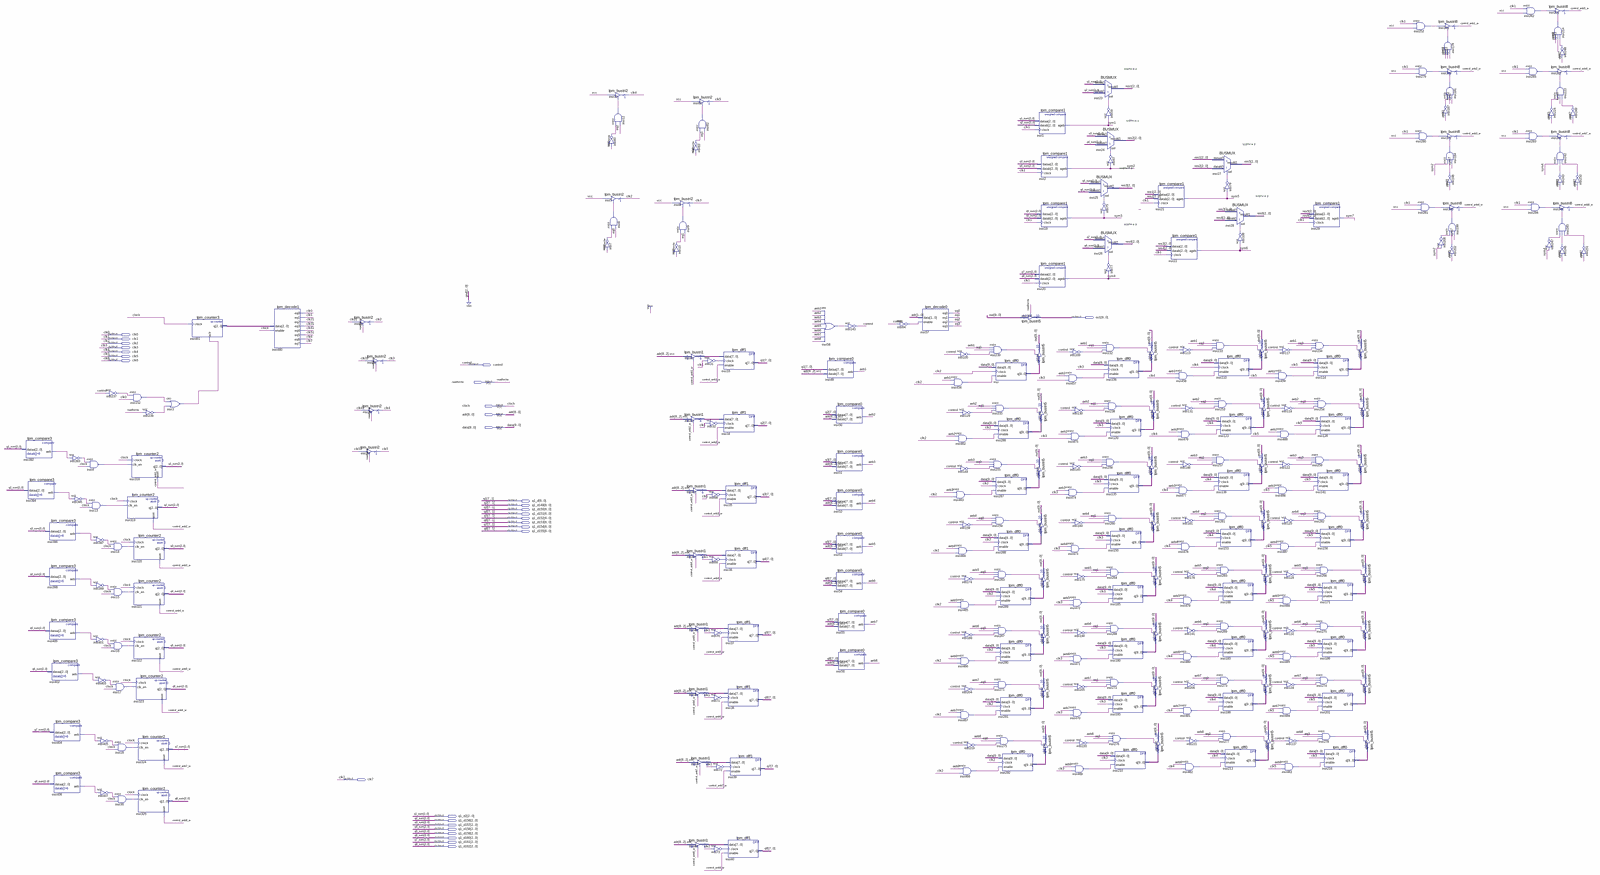
[diagram p0: schematic sheet, whole]
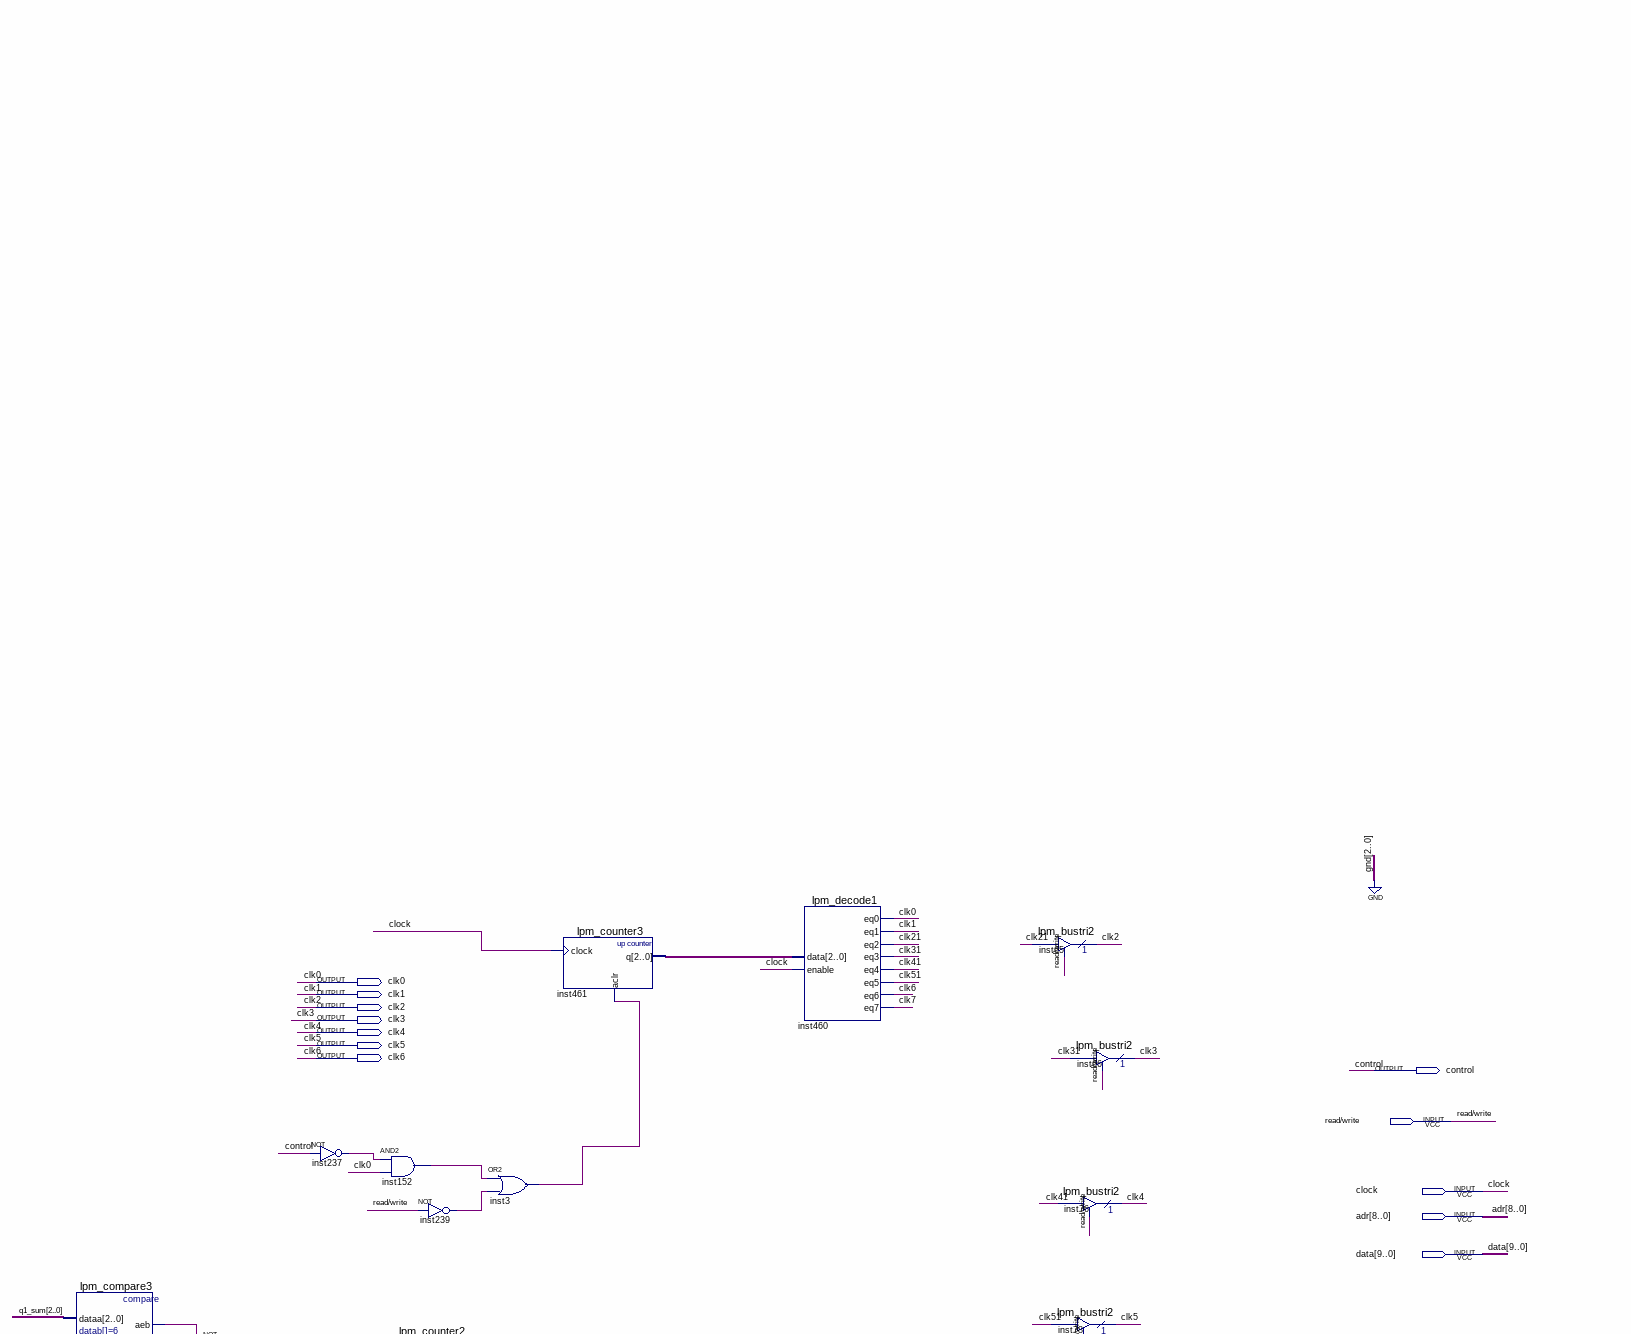
[diagram p1: schematic sheet, upper left part]
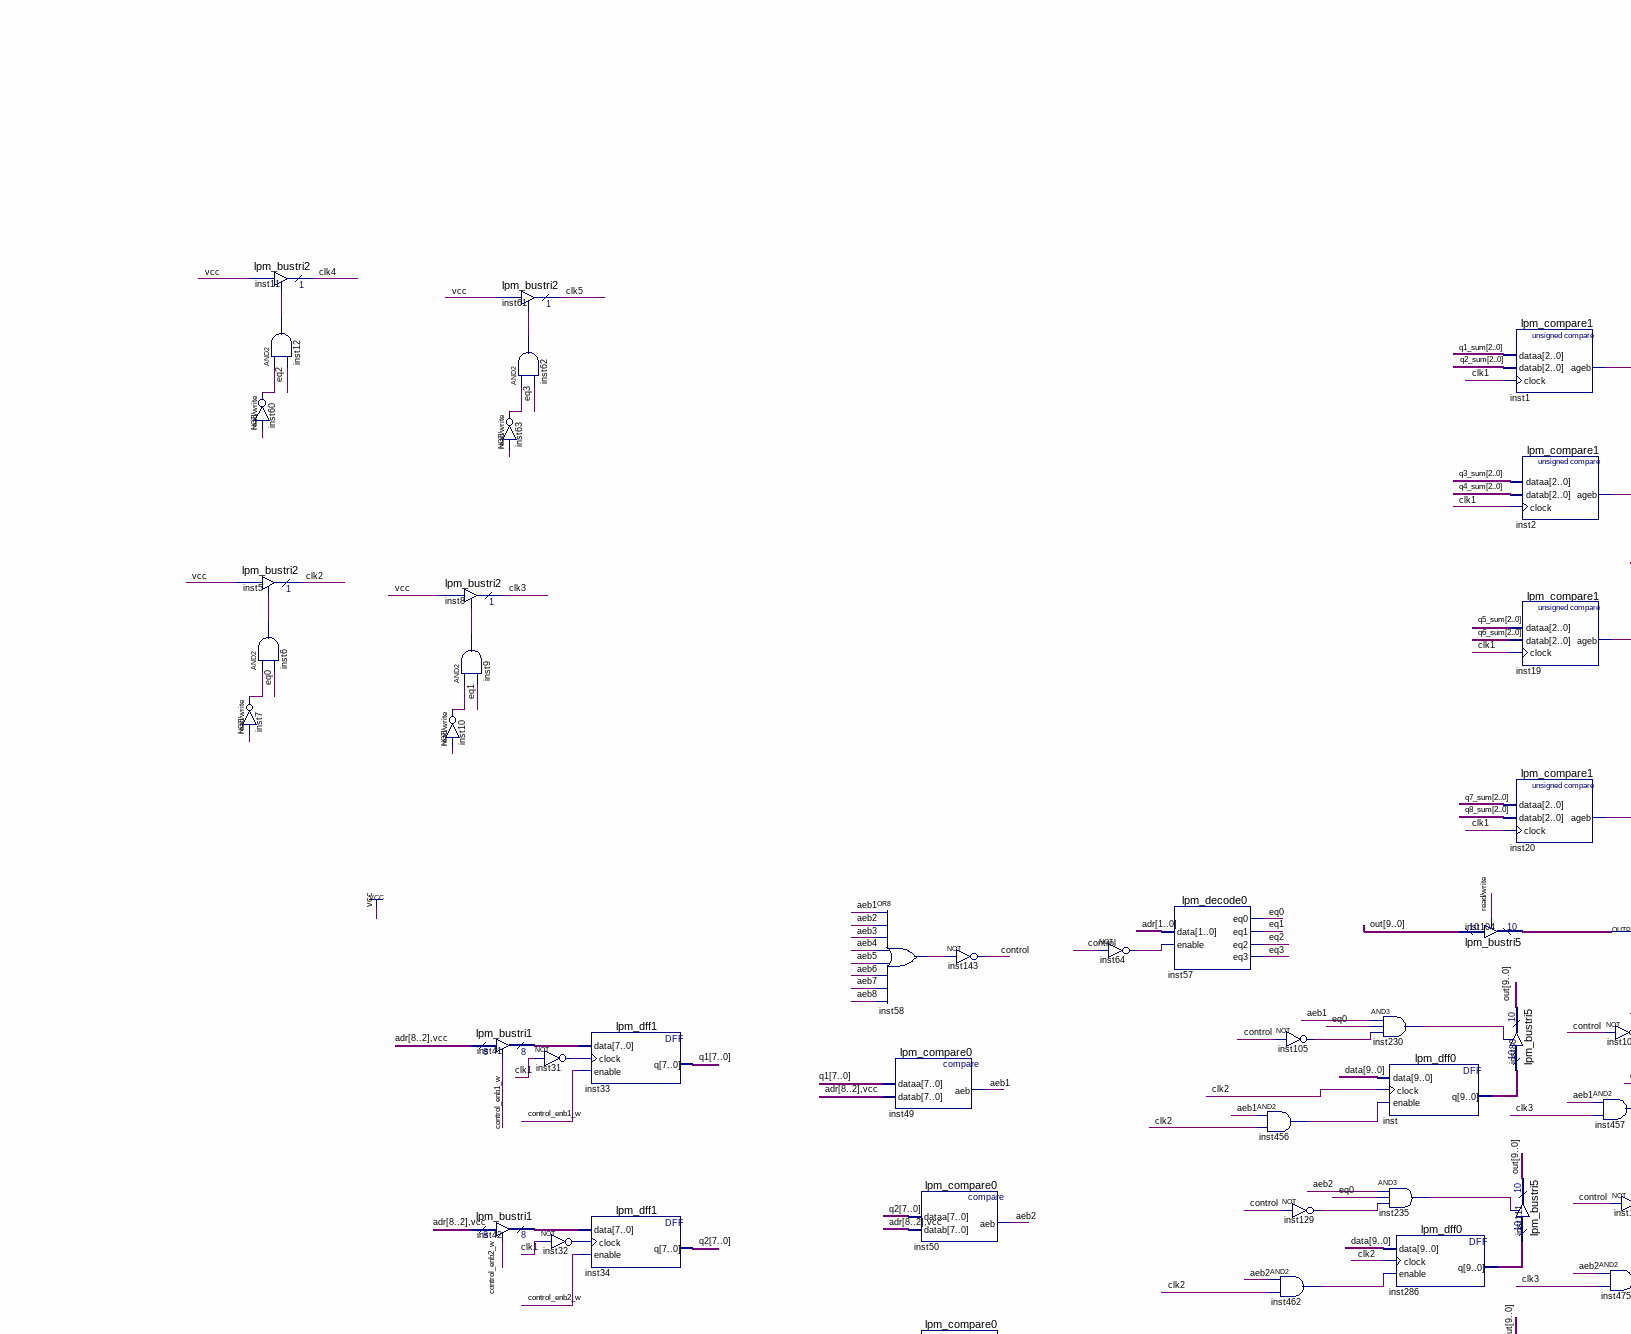
[diagram p2: schematic sheet, upper centre part]
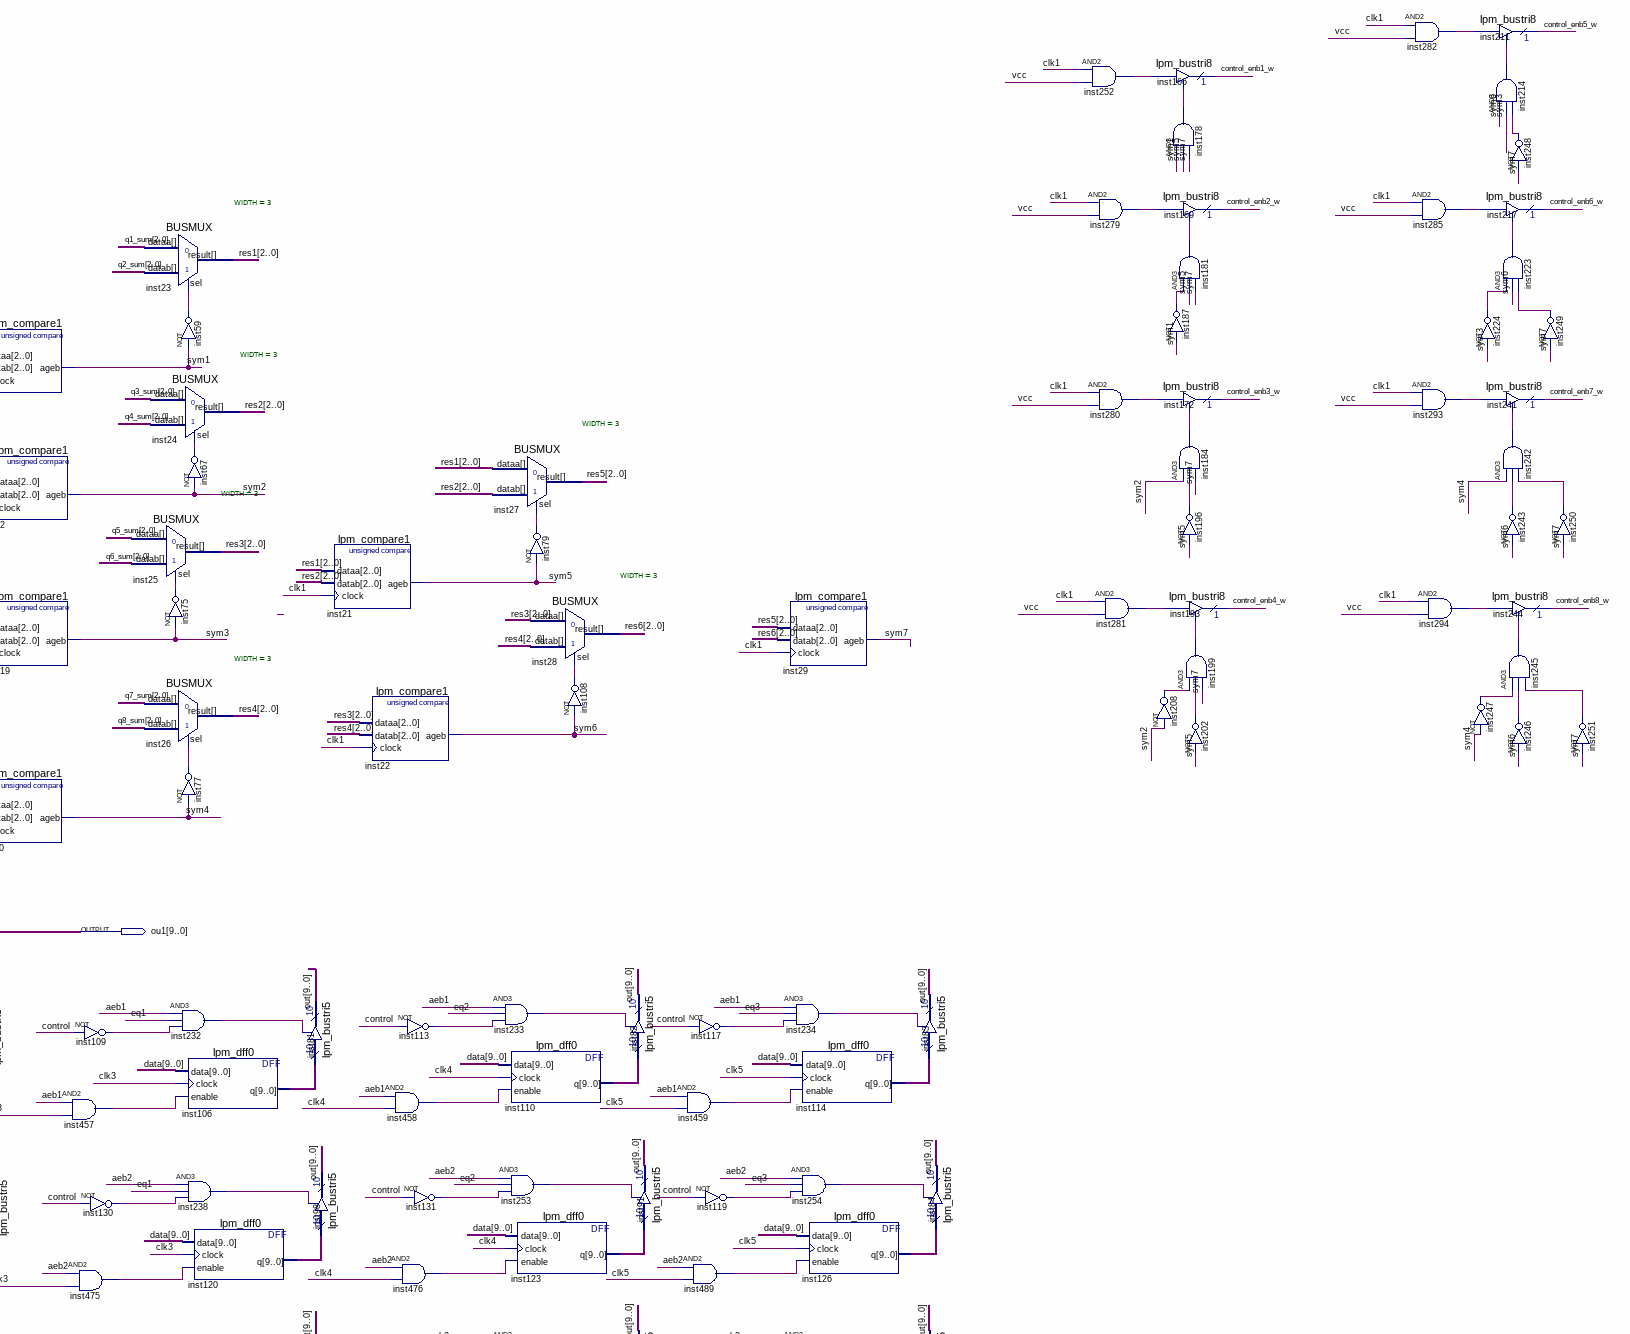
[diagram p3: schematic sheet, upper right part]
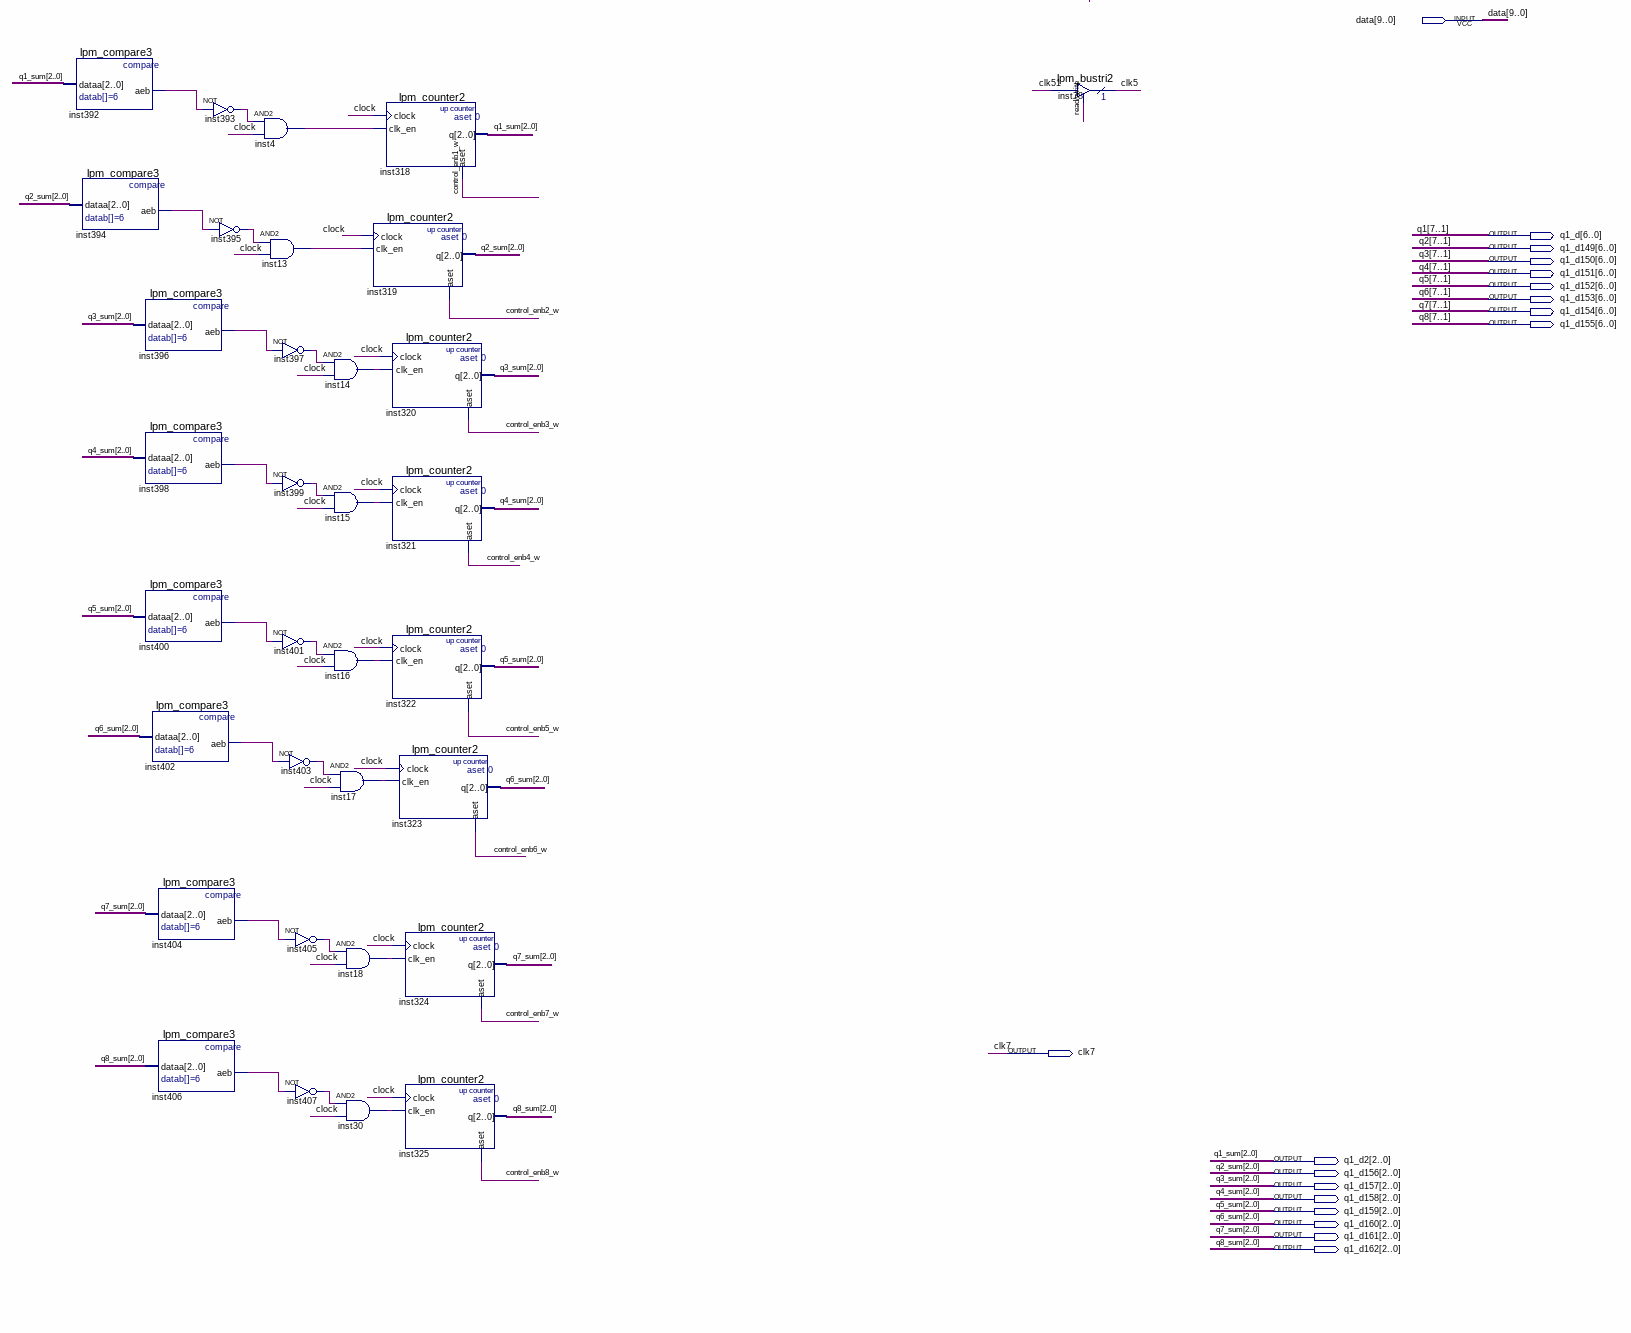
[diagram p4: schematic sheet, lower left part]
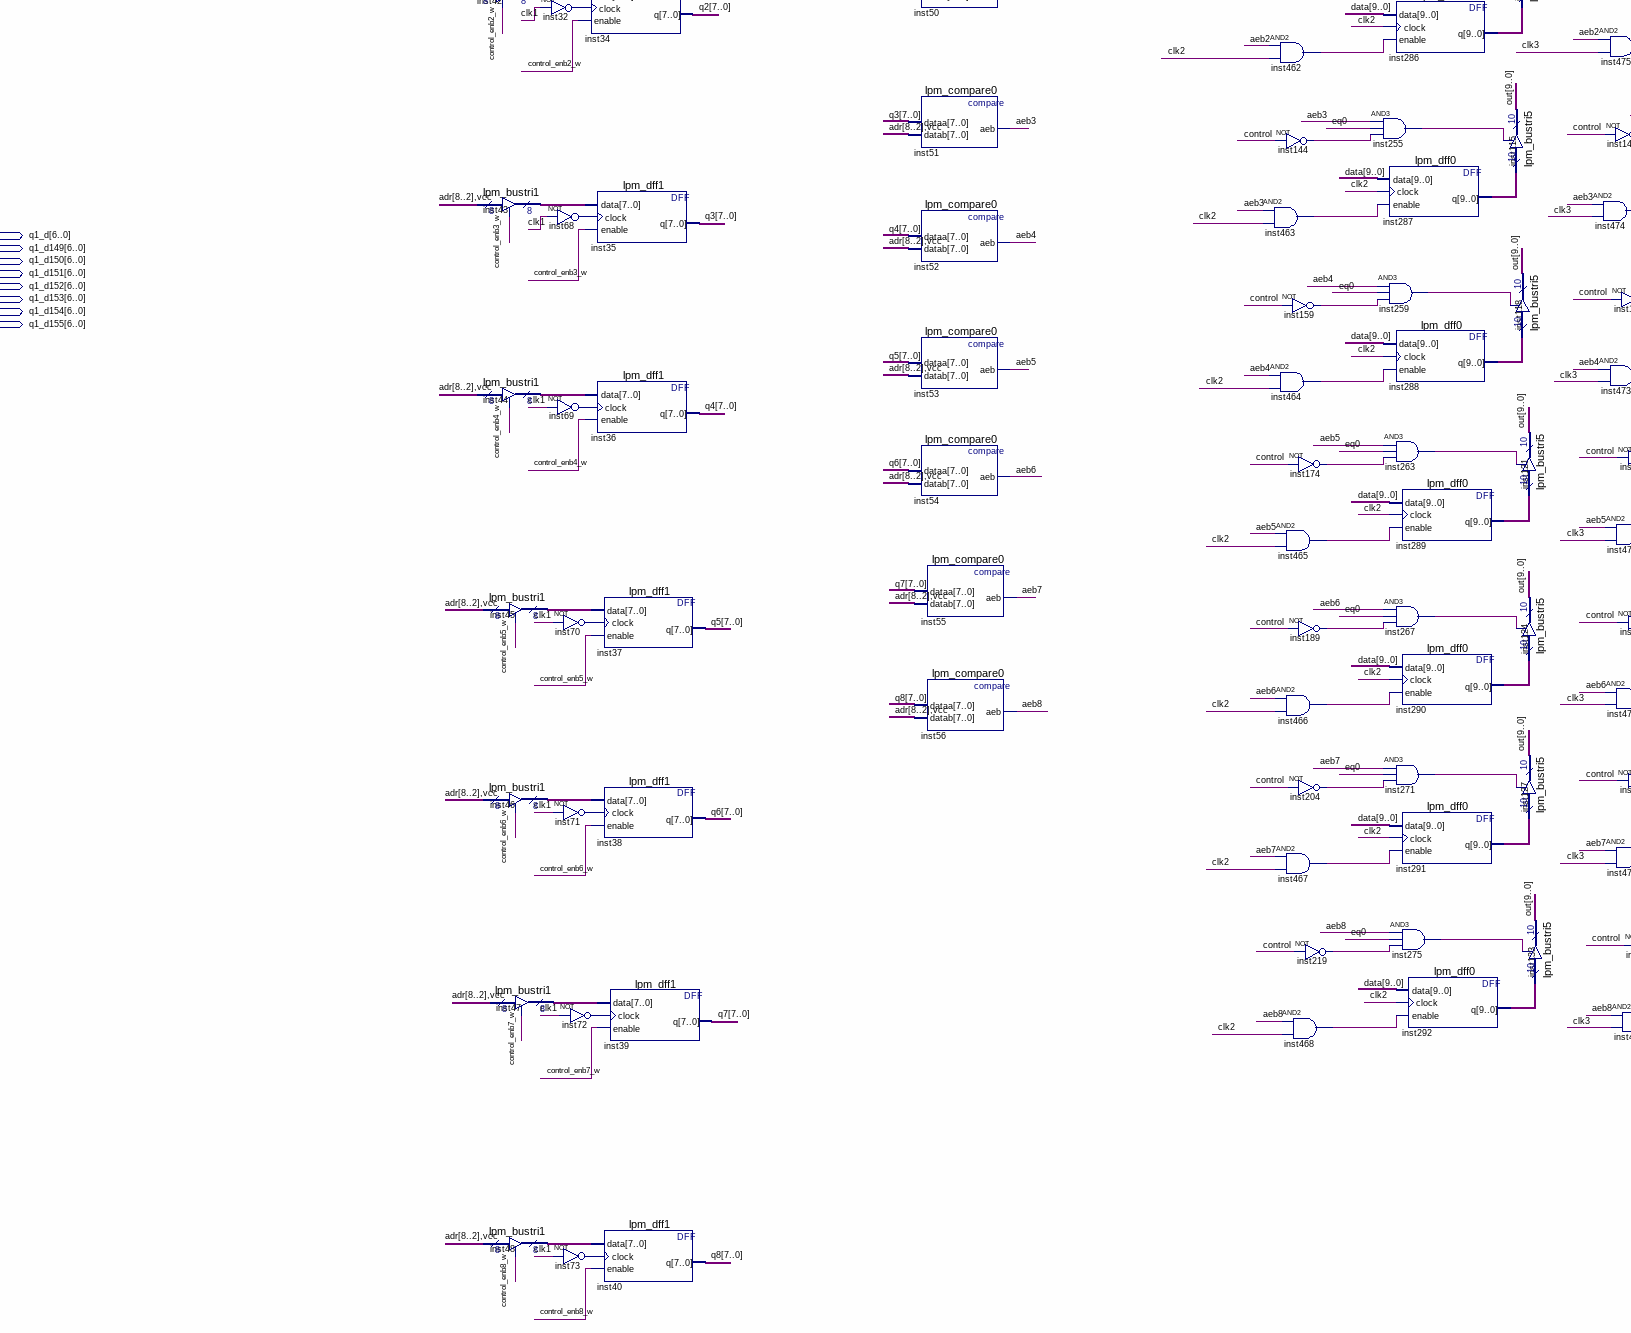
[diagram p5: schematic sheet, lower centre part]
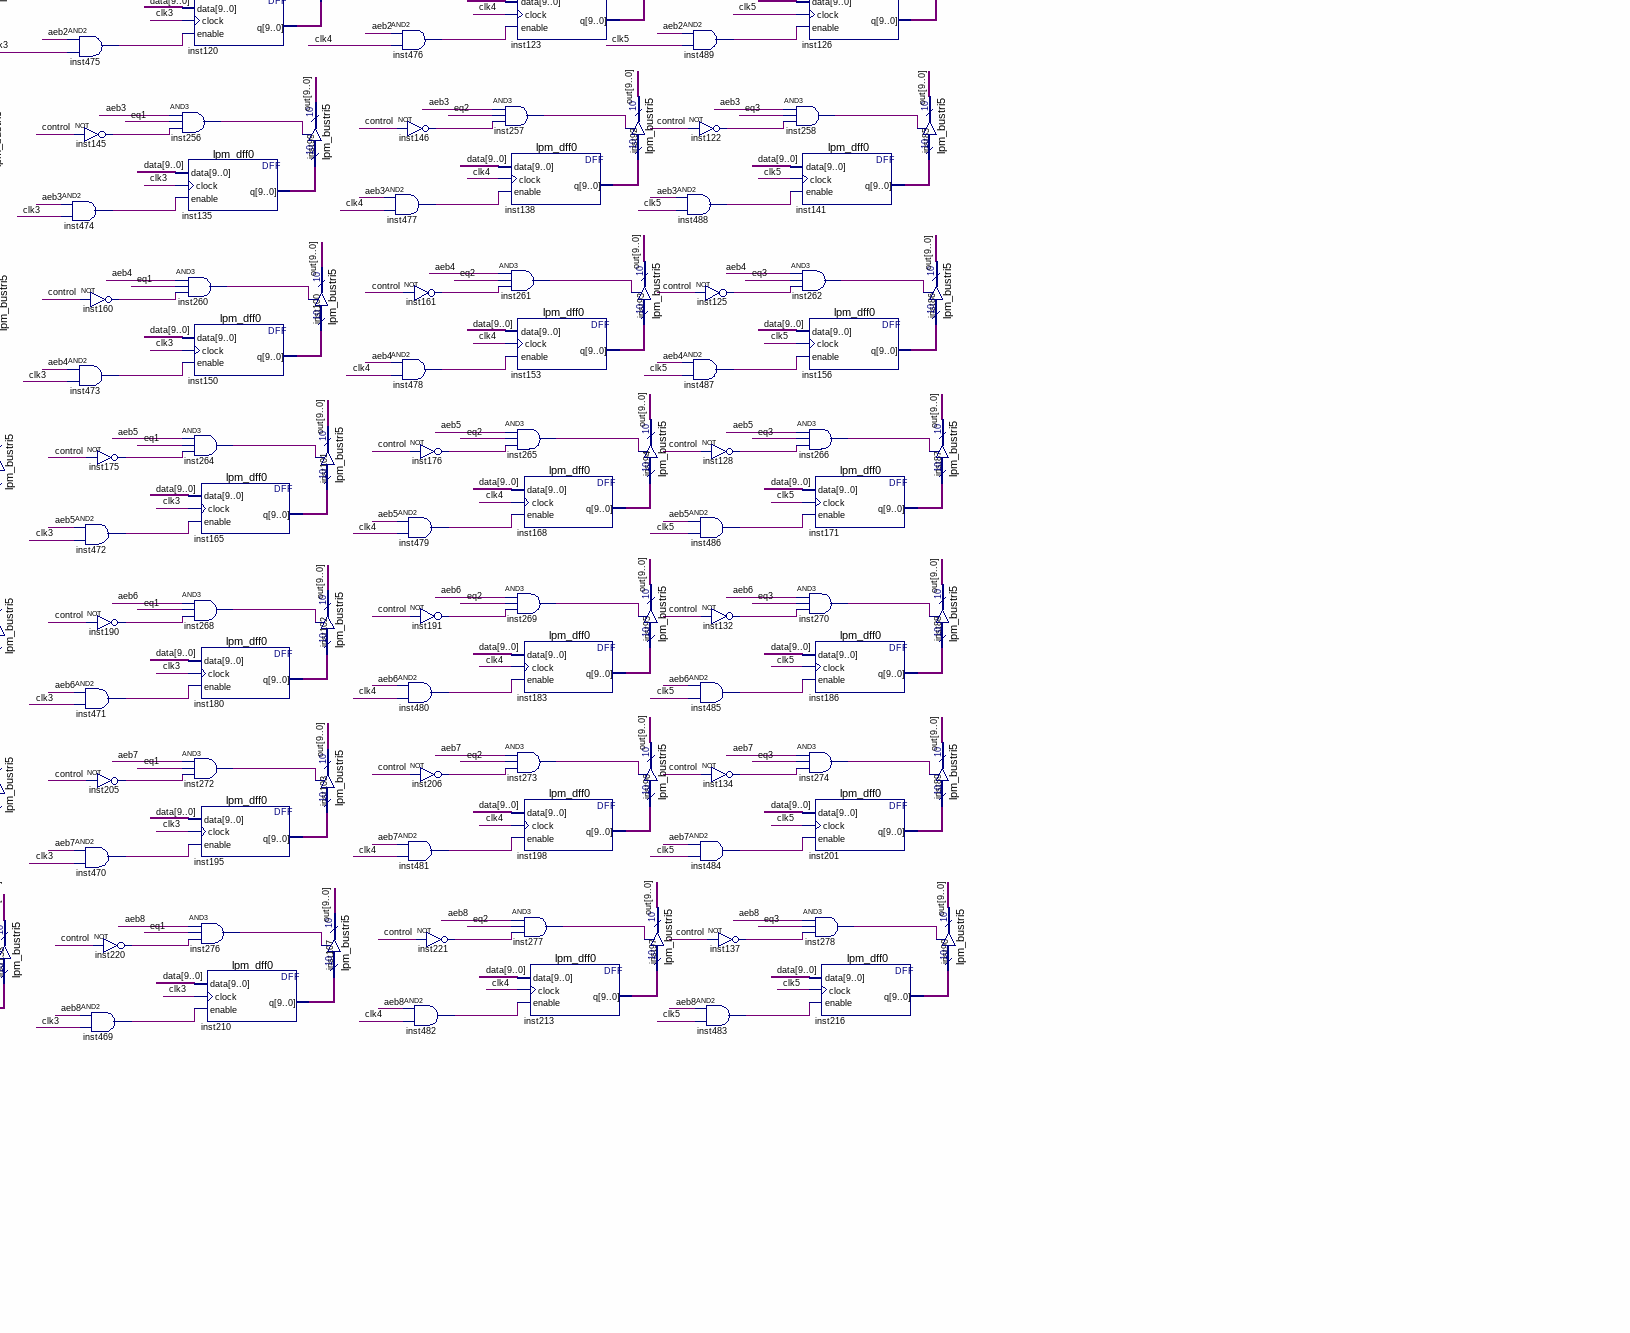
[diagram p6: schematic sheet, lower right part]
// Quartus schematic cache.bdf as structural Verilog: 306 symbols, 30 pins
module cache (
  input  \read/write ,
  input  clock,
  input  [8:0] adr,
  input  [9:0] data,
  output [9:0] ou1,
  output clk0,
  output clk1,
  output clk2,
  output clk3,
  output clk4,
  output clk5,
  output clk6,
  output control,
  output [6:0] q1_d,
  output [6:0] q1_d149,
  output [6:0] q1_d150,
  output [6:0] q1_d151,
  output [6:0] q1_d152,
  output [6:0] q1_d153,
  output [6:0] q1_d154,
  output [6:0] q1_d155,
  output clk7,
  output [2:0] q1_d2,
  output [2:0] q1_d156,
  output [2:0] q1_d157,
  output [2:0] q1_d158,
  output [2:0] q1_d159,
  output [2:0] q1_d160,
  output [2:0] q1_d161,
  output [2:0] q1_d162
);

  wire aeb1, aeb2, aeb3, aeb4, aeb5, aeb6, aeb7, aeb8, clk21, clk31, clk41, clk51, control_enb1_w,
       control_enb2_w, control_enb3_w, control_enb4_w, control_enb5_w, control_enb6_w, control_enb7_w,
       control_enb8_w, eq0, eq1, eq2, eq3, inst3_out, inst4_out, inst6_out, inst7_out, inst9_out, inst10_out,
       inst12_out, inst13_out, inst14_out, inst15_out, inst16_out, inst17_out, inst18_out, inst30_out,
       inst31_out, inst32_out, inst58_out, inst59_out, inst60_out, inst62_out, inst63_out, inst64_out,
       inst67_out, inst68_out, inst69_out, inst70_out, inst71_out, inst72_out, inst73_out, inst75_out,
       inst77_out, inst79_out, inst105_out, inst108_out, inst109_out, inst113_out, inst117_out, inst119_out,
       inst122_out, inst125_out, inst128_out, inst129_out, inst130_out, inst131_out, inst132_out,
       inst134_out, inst137_out, inst144_out, inst145_out, inst146_out, inst152_out, inst159_out,
       inst160_out, inst161_out, inst174_out, inst175_out, inst176_out, inst178_out, inst181_out,
       inst184_out, inst187_out, inst189_out, inst190_out, inst191_out, inst196_out, inst199_out,
       inst202_out, inst204_out, inst205_out, inst206_out, inst208_out, inst214_out, inst219_out,
       inst220_out, inst221_out, inst223_out, inst224_out, inst230_out, inst232_out, inst233_out,
       inst234_out, inst235_out, inst237_out, inst238_out, inst239_out, inst242_out, inst243_out,
       inst245_out, inst246_out, inst247_out, inst248_out, inst249_out, inst250_out, inst251_out,
       inst252_out, inst253_out, inst254_out, inst255_out, inst256_out, inst257_out, inst258_out,
       inst259_out, inst260_out, inst261_out, inst262_out, inst263_out, inst264_out, inst265_out,
       inst266_out, inst267_out, inst268_out, inst269_out, inst270_out, inst271_out, inst272_out,
       inst273_out, inst274_out, inst275_out, inst276_out, inst277_out, inst278_out, inst279_out,
       inst280_out, inst281_out, inst282_out, inst285_out, inst293_out, inst294_out, inst392_aeb,
       inst393_out, inst394_aeb, inst395_out, inst396_aeb, inst397_out, inst398_aeb, inst399_out,
       inst400_aeb, inst401_out, inst402_aeb, inst403_out, inst404_aeb, inst405_out, inst406_aeb,
       inst407_out, inst456_out, inst457_out, inst458_out, inst459_out, inst462_out, inst463_out,
       inst464_out, inst465_out, inst466_out, inst467_out, inst468_out, inst469_out, inst470_out,
       inst471_out, inst472_out, inst473_out, inst474_out, inst475_out, inst476_out, inst477_out,
       inst478_out, inst479_out, inst480_out, inst481_out, inst482_out, inst483_out, inst484_out,
       inst485_out, inst486_out, inst487_out, inst488_out, inst489_out, sym1, sym2, sym3, sym4, sym5, sym6,
       sym7;
  wire [0:0] q1, q2, q3, q4, q5, q6, q7, q8;
  wire [2:0] inst461_q, res1, res2, res3, res4, res5, res6;
  wire [7:0] inst41_tridata, inst42_tridata, inst43_tridata, inst44_tridata, inst45_tridata, inst46_tridata,
       inst47_tridata, inst48_tridata;
  wire [9:0] inst106_q, inst110_q, inst114_q, inst120_q, inst123_q, inst126_q, inst135_q, inst138_q,
       inst141_q, inst150_q, inst153_q, inst156_q, inst165_q, inst168_q, inst171_q, inst180_q, inst183_q,
       inst186_q, inst195_q, inst198_q, inst201_q, inst210_q, inst213_q, inst216_q, inst286_q, inst287_q,
       inst288_q, inst289_q, inst290_q, inst291_q, inst292_q, inst_q, out;

  lpm_compare3 inst392 (.dataa(q1_d2), .aeb(inst392_aeb));
  lpm_compare3 inst394 (.dataa(q1_d156), .aeb(inst394_aeb));
  lpm_compare3 inst396 (.dataa(q1_d157), .aeb(inst396_aeb));
  lpm_compare3 inst398 (.dataa(q1_d158), .aeb(inst398_aeb));
  lpm_compare3 inst400 (.dataa(q1_d159), .aeb(inst400_aeb));
  lpm_compare3 inst402 (.dataa(q1_d160), .aeb(inst402_aeb));
  lpm_compare3 inst404 (.dataa(q1_d161), .aeb(inst404_aeb));
  lpm_compare3 inst406 (.dataa(q1_d162), .aeb(inst406_aeb));
  not inst393 (inst393_out, inst392_aeb);
  not inst395 (inst395_out, inst394_aeb);
  and inst4 (inst4_out, inst393_out, clock);
  and inst13 (inst13_out, inst395_out, clock);
  not inst397 (inst397_out, inst396_aeb);
  not inst399 (inst399_out, inst398_aeb);
  not inst401 (inst401_out, inst400_aeb);
  not inst403 (inst403_out, inst402_aeb);
  not inst405 (inst405_out, inst404_aeb);
  not inst407 (inst407_out, inst406_aeb);
  not inst237 (inst237_out, control);
  and inst14 (inst14_out, inst397_out, clock);
  and inst15 (inst15_out, inst399_out, clock);
  and inst16 (inst16_out, inst401_out, clock);
  and inst17 (inst17_out, inst403_out, clock);
  and inst18 (inst18_out, inst405_out, clock);
  and inst30 (inst30_out, inst407_out, clock);
  and inst152 (inst152_out, inst237_out, clk0);
  lpm_counter2 inst318 (.clock(clock), .clk_en(inst4_out), .aset(control_enb1_w), .q(q1_d2));
  lpm_counter2 inst319 (.clock(clock), .clk_en(inst13_out), .aset(control_enb2_w), .q(q1_d156));
  lpm_counter2 inst320 (.clock(clock), .clk_en(inst14_out), .aset(control_enb3_w), .q(q1_d157));
  lpm_counter2 inst321 (.clock(clock), .clk_en(inst15_out), .aset(control_enb4_w), .q(q1_d158));
  lpm_counter2 inst322 (.clock(clock), .clk_en(inst16_out), .aset(control_enb5_w), .q(q1_d159));
  lpm_counter2 inst323 (.clock(clock), .clk_en(inst17_out), .aset(control_enb6_w), .q(q1_d160));
  lpm_counter2 inst324 (.clock(clock), .clk_en(inst18_out), .aset(control_enb7_w), .q(q1_d161));
  lpm_counter2 inst325 (.clock(clock), .clk_en(inst30_out), .aset(control_enb8_w), .q(q1_d162));
  not inst239 (inst239_out, \read/write );
  or inst3 (inst3_out, inst152_out, inst239_out);
  lpm_counter3 inst461 (.clock(clock), .aclr(inst3_out), .q(inst461_q));
  lpm_decode1 inst460 (
    .data(inst461_q), .enable(clock), .eq0(clk0), .eq1(clk1), .eq2(clk21), .eq3(clk31), .eq4(clk41),
    .eq5(clk51), .eq6(clk6), .eq7(clk7));
  lpm_bustri2 inst65 (.enabledt(\read/write ), .data(clk21), .tridata(clk2));
  lpm_bustri2 inst78 (.enabledt(\read/write ), .data(clk51), .tridata(clk5));
  lpm_bustri2 inst66 (.enabledt(\read/write ), .data(clk31), .tridata(clk3));
  lpm_bustri2 inst76 (.enabledt(\read/write ), .data(clk41), .tridata(clk4));
  lpm_bustri2 inst11 (.enabledt(inst12_out), .data(1'b1), .tridata(clk4));
  and inst12 (inst12_out, inst60_out, eq2);
  not inst60 (inst60_out, \read/write );
  lpm_bustri2 inst5 (.enabledt(inst6_out), .data(1'b1), .tridata(clk2));
  and inst6 (inst6_out, inst7_out, eq0);
  not inst7 (inst7_out, \read/write );
  lpm_bustri2 inst8 (.enabledt(inst9_out), .data(1'b1), .tridata(clk3));
  and inst9 (inst9_out, inst10_out, eq1);
  not inst10 (inst10_out, \read/write );
  lpm_bustri1 inst41 (.enabledt(control_enb1_w), .data({adr[8:2], 1'b1}), .tridata(inst41_tridata));
  lpm_bustri1 inst42 (.enabledt(control_enb2_w), .data({adr[8:2], 1'b1}), .tridata(inst42_tridata));
  lpm_bustri1 inst43 (.enabledt(control_enb3_w), .data({adr[8:2], 1'b1}), .tridata(inst43_tridata));
  lpm_bustri1 inst44 (.enabledt(control_enb4_w), .data({adr[8:2], 1'b1}), .tridata(inst44_tridata));
  lpm_bustri1 inst45 (.enabledt(control_enb5_w), .data({adr[8:2], 1'b1}), .tridata(inst45_tridata));
  lpm_bustri1 inst46 (.enabledt(control_enb6_w), .data({adr[8:2], 1'b1}), .tridata(inst46_tridata));
  lpm_bustri1 inst48 (.enabledt(control_enb8_w), .data({adr[8:2], 1'b1}), .tridata(inst48_tridata));
  lpm_bustri2 inst61 (.enabledt(inst62_out), .data(1'b1), .tridata(clk5));
  and inst62 (inst62_out, inst63_out, eq3);
  not inst63 (inst63_out, \read/write );
  not inst31 (inst31_out, clk1);
  lpm_bustri1 inst47 (.enabledt(control_enb7_w), .data({adr[8:2], 1'b1}), .tridata(inst47_tridata));
  lpm_dff1 inst33 (.data(inst41_tridata), .clock(inst31_out), .enable(control_enb1_w), .q({q1_d, q1[0]}));
  lpm_dff1 inst34 (.data(inst42_tridata), .clock(inst32_out), .enable(control_enb2_w), .q({q1_d149, q2[0]}));
  not inst32 (inst32_out, clk1);
  lpm_dff1 inst35 (.data(inst43_tridata), .clock(inst68_out), .enable(control_enb3_w), .q({q1_d150, q3[0]}));
  not inst68 (inst68_out, clk1);
  lpm_dff1 inst36 (.data(inst44_tridata), .clock(inst69_out), .enable(control_enb4_w), .q({q1_d151, q4[0]}));
  not inst69 (inst69_out, clk1);
  not inst70 (inst70_out, clk1);
  not inst71 (inst71_out, clk1);
  not inst72 (inst72_out, clk1);
  not inst73 (inst73_out, clk1);
  lpm_dff1 inst37 (.data(inst45_tridata), .clock(inst70_out), .enable(control_enb5_w), .q({q1_d152, q5[0]}));
  lpm_dff1 inst38 (.data(inst46_tridata), .clock(inst71_out), .enable(control_enb6_w), .q({q1_d153, q6[0]}));
  lpm_dff1 inst39 (.data(inst47_tridata), .clock(inst72_out), .enable(control_enb7_w), .q({q1_d154, q7[0]}));
  lpm_dff1 inst40 (.data(inst48_tridata), .clock(inst73_out), .enable(control_enb8_w), .q({q1_d155, q8[0]}));
  or inst58 (inst58_out, aeb1, aeb2, aeb3, aeb4, aeb5, aeb6, aeb7, aeb8);
  lpm_compare0 inst49 (.dataa({q1_d, q1[0]}), .datab({adr[8:2], 1'b1}), .aeb(aeb1));
  lpm_compare0 inst50 (.dataa({q1_d149, q2[0]}), .datab({adr[8:2], 1'b1}), .aeb(aeb2));
  lpm_compare0 inst51 (.dataa({q1_d150, q3[0]}), .datab({adr[8:2], 1'b1}), .aeb(aeb3));
  lpm_compare0 inst52 (.dataa({q1_d151, q4[0]}), .datab({adr[8:2], 1'b1}), .aeb(aeb4));
  lpm_compare0 inst53 (.dataa({q1_d152, q5[0]}), .datab({adr[8:2], 1'b1}), .aeb(aeb5));
  lpm_compare0 inst54 (.dataa({q1_d153, q6[0]}), .datab({adr[8:2], 1'b1}), .aeb(aeb6));
  lpm_compare0 inst55 (.dataa({q1_d154, q7[0]}), .datab({adr[8:2], 1'b1}), .aeb(aeb7));
  lpm_compare0 inst56 (.dataa({q1_d155, q8[0]}), .datab({adr[8:2], 1'b1}), .aeb(aeb8));
  not inst143 (control, inst58_out);
  not inst64 (inst64_out, control);
  lpm_decode0 inst57 (.data(adr[1:0]), .enable(inst64_out), .eq0(eq0), .eq1(eq1), .eq2(eq2), .eq3(eq3));
  not inst105 (inst105_out, control);
  and inst456 (inst456_out, aeb1, clk2);
  not inst129 (inst129_out, control);
  and inst462 (inst462_out, aeb2, clk2);
  not inst144 (inst144_out, control);
  and inst463 (inst463_out, aeb3, clk2);
  not inst159 (inst159_out, control);
  and inst464 (inst464_out, aeb4, clk2);
  not inst174 (inst174_out, control);
  and inst465 (inst465_out, aeb5, clk2);
  not inst189 (inst189_out, control);
  and inst466 (inst466_out, aeb6, clk2);
  not inst204 (inst204_out, control);
  and inst467 (inst467_out, aeb7, clk2);
  not inst219 (inst219_out, control);
  and inst468 (inst468_out, aeb8, clk2);
  and inst230 (inst230_out, aeb1, eq0, inst105_out);
  lpm_dff0 inst (.data(data), .clock(clk2), .enable(inst456_out), .q(inst_q));
  and inst235 (inst235_out, aeb2, eq0, inst129_out);
  lpm_dff0 inst286 (.data(data), .clock(clk2), .enable(inst462_out), .q(inst286_q));
  and inst255 (inst255_out, aeb3, eq0, inst144_out);
  lpm_dff0 inst287 (.data(data), .clock(clk2), .enable(inst463_out), .q(inst287_q));
  and inst259 (inst259_out, aeb4, eq0, inst159_out);
  lpm_dff0 inst288 (.data(data), .clock(clk2), .enable(inst464_out), .q(inst288_q));
  and inst263 (inst263_out, aeb5, eq0, inst174_out);
  lpm_dff0 inst289 (.data(data), .clock(clk2), .enable(inst465_out), .q(inst289_q));
  and inst267 (inst267_out, aeb6, eq0, inst189_out);
  lpm_dff0 inst290 (.data(data), .clock(clk2), .enable(inst466_out), .q(inst290_q));
  and inst271 (inst271_out, aeb7, eq0, inst204_out);
  lpm_dff0 inst291 (.data(data), .clock(clk2), .enable(inst467_out), .q(inst291_q));
  and inst275 (inst275_out, aeb8, eq0, inst219_out);
  lpm_dff0 inst292 (.data(data), .clock(clk2), .enable(inst468_out), .q(inst292_q));
  lpm_bustri5 inst104 (.enabledt(\read/write ), .data(out), .tridata(ou1));
  lpm_compare1 inst1 (.dataa(q1_d2), .datab(q1_d156), .clock(clk1), .ageb(sym1));
  lpm_compare1 inst2 (.dataa(q1_d157), .datab(q1_d158), .clock(clk1), .ageb(sym2));
  lpm_compare1 inst19 (.dataa(q1_d159), .datab(q1_d160), .clock(clk1), .ageb(sym3));
  lpm_compare1 inst20 (.dataa(q1_d161), .datab(q1_d162), .clock(clk1), .ageb(sym4));
  lpm_bustri5 inst80 (.enabledt(inst230_out), .data(inst_q), .tridata(out));
  lpm_bustri5 inst111 (.enabledt(inst235_out), .data(inst286_q), .tridata(out));
  lpm_bustri5 inst115 (.enabledt(inst255_out), .data(inst287_q), .tridata(out));
  lpm_bustri5 inst118 (.enabledt(inst259_out), .data(inst288_q), .tridata(out));
  lpm_bustri5 inst121 (.enabledt(inst263_out), .data(inst289_q), .tridata(out));
  lpm_bustri5 inst124 (.enabledt(inst267_out), .data(inst290_q), .tridata(out));
  lpm_bustri5 inst127 (.enabledt(inst271_out), .data(inst291_q), .tridata(out));
  lpm_bustri5 inst133 (.enabledt(inst275_out), .data(inst292_q), .tridata(out));
  and inst457 (inst457_out, aeb1, clk3);
  and inst475 (inst475_out, aeb2, clk3);
  and inst474 (inst474_out, aeb3, clk3);
  and inst473 (inst473_out, aeb4, clk3);
  not inst109 (inst109_out, control);
  not inst130 (inst130_out, control);
  not inst145 (inst145_out, control);
  not inst160 (inst160_out, control);
  not inst175 (inst175_out, control);
  and inst472 (inst472_out, aeb5, clk3);
  not inst190 (inst190_out, control);
  and inst471 (inst471_out, aeb6, clk3);
  not inst205 (inst205_out, control);
  and inst470 (inst470_out, aeb7, clk3);
  not inst220 (inst220_out, control);
  and inst469 (inst469_out, aeb8, clk3);
  BUSMUX #(.WIDTH(3)) inst23 (.datab(q1_d156), .sel(inst59_out), .dataa(q1_d2), .result(res1));
  BUSMUX #(.WIDTH(3)) inst24 (.datab(q1_d158), .sel(inst67_out), .dataa(q1_d157), .result(res2));
  BUSMUX #(.WIDTH(3)) inst25 (.datab(q1_d160), .sel(inst75_out), .dataa(q1_d159), .result(res3));
  not inst75 (inst75_out, sym3);
  BUSMUX #(.WIDTH(3)) inst26 (.datab(q1_d162), .sel(inst77_out), .dataa(q1_d161), .result(res4));
  and inst232 (inst232_out, aeb1, eq1, inst109_out);
  and inst256 (inst256_out, aeb3, eq1, inst145_out);
  not inst59 (inst59_out, sym1);
  not inst67 (inst67_out, sym2);
  not inst77 (inst77_out, sym4);
  lpm_dff0 inst106 (.data(data), .clock(clk3), .enable(inst457_out), .q(inst106_q));
  and inst238 (inst238_out, aeb2, eq1, inst130_out);
  lpm_dff0 inst120 (.data(data), .clock(clk3), .enable(inst475_out), .q(inst120_q));
  lpm_dff0 inst135 (.data(data), .clock(clk3), .enable(inst474_out), .q(inst135_q));
  and inst260 (inst260_out, aeb4, eq1, inst160_out);
  lpm_dff0 inst150 (.data(data), .clock(clk3), .enable(inst473_out), .q(inst150_q));
  and inst264 (inst264_out, aeb5, eq1, inst175_out);
  lpm_dff0 inst165 (.data(data), .clock(clk3), .enable(inst472_out), .q(inst165_q));
  and inst268 (inst268_out, aeb6, eq1, inst190_out);
  lpm_dff0 inst180 (.data(data), .clock(clk3), .enable(inst471_out), .q(inst180_q));
  and inst272 (inst272_out, aeb7, eq1, inst205_out);
  lpm_dff0 inst195 (.data(data), .clock(clk3), .enable(inst470_out), .q(inst195_q));
  and inst276 (inst276_out, aeb8, eq1, inst220_out);
  lpm_dff0 inst210 (.data(data), .clock(clk3), .enable(inst469_out), .q(inst210_q));
  lpm_compare1 inst21 (.dataa(res1), .datab(res2), .clock(clk1), .ageb(sym5));
  lpm_bustri5 inst81 (.enabledt(inst232_out), .data(inst106_q), .tridata(out));
  lpm_bustri5 inst98 (.enabledt(inst238_out), .data(inst120_q), .tridata(out));
  lpm_bustri5 inst99 (.enabledt(inst256_out), .data(inst135_q), .tridata(out));
  lpm_bustri5 inst100 (.enabledt(inst260_out), .data(inst150_q), .tridata(out));
  lpm_bustri5 inst101 (.enabledt(inst264_out), .data(inst165_q), .tridata(out));
  lpm_bustri5 inst102 (.enabledt(inst268_out), .data(inst180_q), .tridata(out));
  lpm_bustri5 inst103 (.enabledt(inst272_out), .data(inst195_q), .tridata(out));
  lpm_bustri5 inst107 (.enabledt(inst276_out), .data(inst210_q), .tridata(out));
  lpm_compare1 inst22 (.dataa(res3), .datab(res4), .clock(clk1), .ageb(sym6));
  not inst113 (inst113_out, control);
  and inst458 (inst458_out, aeb1, clk4);
  not inst131 (inst131_out, control);
  and inst476 (inst476_out, aeb2, clk4);
  not inst146 (inst146_out, control);
  and inst477 (inst477_out, aeb3, clk4);
  not inst161 (inst161_out, control);
  and inst478 (inst478_out, aeb4, clk4);
  not inst176 (inst176_out, control);
  and inst479 (inst479_out, aeb5, clk4);
  not inst191 (inst191_out, control);
  and inst480 (inst480_out, aeb6, clk4);
  not inst206 (inst206_out, control);
  and inst481 (inst481_out, aeb7, clk4);
  not inst221 (inst221_out, control);
  and inst482 (inst482_out, aeb8, clk4);
  BUSMUX #(.WIDTH(3)) inst27 (.datab(res2), .sel(inst79_out), .dataa(res1), .result(res5));
  not inst79 (inst79_out, sym5);
  and inst233 (inst233_out, aeb1, eq2, inst113_out);
  lpm_dff0 inst110 (.data(data), .clock(clk4), .enable(inst458_out), .q(inst110_q));
  and inst253 (inst253_out, aeb2, eq2, inst131_out);
  lpm_dff0 inst123 (.data(data), .clock(clk4), .enable(inst476_out), .q(inst123_q));
  and inst257 (inst257_out, aeb3, eq2, inst146_out);
  lpm_dff0 inst138 (.data(data), .clock(clk4), .enable(inst477_out), .q(inst138_q));
  and inst261 (inst261_out, aeb4, eq2, inst161_out);
  lpm_dff0 inst153 (.data(data), .clock(clk4), .enable(inst478_out), .q(inst153_q));
  and inst265 (inst265_out, aeb5, eq2, inst176_out);
  lpm_dff0 inst168 (.data(data), .clock(clk4), .enable(inst479_out), .q(inst168_q));
  and inst269 (inst269_out, aeb6, eq2, inst191_out);
  lpm_dff0 inst183 (.data(data), .clock(clk4), .enable(inst480_out), .q(inst183_q));
  and inst273 (inst273_out, aeb7, eq2, inst206_out);
  lpm_dff0 inst198 (.data(data), .clock(clk4), .enable(inst481_out), .q(inst198_q));
  and inst277 (inst277_out, aeb8, eq2, inst221_out);
  lpm_dff0 inst213 (.data(data), .clock(clk4), .enable(inst482_out), .q(inst213_q));
  BUSMUX #(.WIDTH(3)) inst28 (.datab(res4), .sel(inst108_out), .dataa(res3), .result(res6));
  not inst108 (inst108_out, sym6);
  lpm_bustri5 inst82 (.enabledt(inst233_out), .data(inst110_q), .tridata(out));
  lpm_bustri5 inst92 (.enabledt(inst257_out), .data(inst138_q), .tridata(out));
  and inst459 (inst459_out, aeb1, clk5);
  lpm_bustri5 inst91 (.enabledt(inst253_out), .data(inst123_q), .tridata(out));
  and inst488 (inst488_out, aeb3, clk5);
  lpm_bustri5 inst93 (.enabledt(inst261_out), .data(inst153_q), .tridata(out));
  lpm_bustri5 inst94 (.enabledt(inst265_out), .data(inst168_q), .tridata(out));
  lpm_bustri5 inst95 (.enabledt(inst269_out), .data(inst183_q), .tridata(out));
  lpm_bustri5 inst96 (.enabledt(inst273_out), .data(inst198_q), .tridata(out));
  lpm_bustri5 inst97 (.enabledt(inst277_out), .data(inst213_q), .tridata(out));
  not inst117 (inst117_out, control);
  not inst119 (inst119_out, control);
  and inst489 (inst489_out, aeb2, clk5);
  not inst122 (inst122_out, control);
  not inst125 (inst125_out, control);
  and inst487 (inst487_out, aeb4, clk5);
  not inst128 (inst128_out, control);
  and inst486 (inst486_out, aeb5, clk5);
  not inst132 (inst132_out, control);
  and inst485 (inst485_out, aeb6, clk5);
  not inst134 (inst134_out, control);
  and inst484 (inst484_out, aeb7, clk5);
  not inst137 (inst137_out, control);
  and inst483 (inst483_out, aeb8, clk5);
  lpm_compare1 inst29 (.dataa(res5), .datab(res6), .clock(clk1), .ageb(sym7));
  and inst234 (inst234_out, aeb1, eq3, inst117_out);
  lpm_dff0 inst114 (.data(data), .clock(clk5), .enable(inst459_out), .q(inst114_q));
  and inst254 (inst254_out, aeb2, eq3, inst119_out);
  lpm_dff0 inst126 (.data(data), .clock(clk5), .enable(inst489_out), .q(inst126_q));
  and inst258 (inst258_out, aeb3, eq3, inst122_out);
  lpm_dff0 inst141 (.data(data), .clock(clk5), .enable(inst488_out), .q(inst141_q));
  and inst262 (inst262_out, aeb4, eq3, inst125_out);
  lpm_dff0 inst156 (.data(data), .clock(clk5), .enable(inst487_out), .q(inst156_q));
  and inst266 (inst266_out, aeb5, eq3, inst128_out);
  lpm_dff0 inst171 (.data(data), .clock(clk5), .enable(inst486_out), .q(inst171_q));
  and inst270 (inst270_out, aeb6, eq3, inst132_out);
  lpm_dff0 inst186 (.data(data), .clock(clk5), .enable(inst485_out), .q(inst186_q));
  and inst274 (inst274_out, aeb7, eq3, inst134_out);
  lpm_dff0 inst201 (.data(data), .clock(clk5), .enable(inst484_out), .q(inst201_q));
  and inst278 (inst278_out, aeb8, eq3, inst137_out);
  lpm_dff0 inst216 (.data(data), .clock(clk5), .enable(inst483_out), .q(inst216_q));
  lpm_bustri5 inst83 (.enabledt(inst234_out), .data(inst114_q), .tridata(out));
  lpm_bustri5 inst84 (.enabledt(inst254_out), .data(inst126_q), .tridata(out));
  lpm_bustri5 inst85 (.enabledt(inst258_out), .data(inst141_q), .tridata(out));
  lpm_bustri5 inst86 (.enabledt(inst262_out), .data(inst156_q), .tridata(out));
  lpm_bustri5 inst87 (.enabledt(inst266_out), .data(inst171_q), .tridata(out));
  lpm_bustri5 inst88 (.enabledt(inst270_out), .data(inst186_q), .tridata(out));
  lpm_bustri5 inst89 (.enabledt(inst274_out), .data(inst201_q), .tridata(out));
  lpm_bustri5 inst90 (.enabledt(inst278_out), .data(inst216_q), .tridata(out));
  and inst252 (inst252_out, clk1, 1'b1);
  and inst279 (inst279_out, clk1, 1'b1);
  and inst280 (inst280_out, clk1, 1'b1);
  and inst281 (inst281_out, clk1, 1'b1);
  lpm_bustri8 inst166 (.enabledt(inst178_out), .data(inst252_out), .tridata(control_enb1_w));
  and inst178 (inst178_out, sym1, sym5, sym7);
  lpm_bustri8 inst169 (.enabledt(inst181_out), .data(inst279_out), .tridata(control_enb2_w));
  and inst181 (inst181_out, inst187_out, sym5, sym7);
  not inst187 (inst187_out, sym1);
  lpm_bustri8 inst172 (.enabledt(inst184_out), .data(inst280_out), .tridata(control_enb3_w));
  and inst184 (inst184_out, sym2, inst196_out, sym7);
  not inst196 (inst196_out, sym5);
  lpm_bustri8 inst193 (.enabledt(inst199_out), .data(inst281_out), .tridata(control_enb4_w));
  and inst199 (inst199_out, inst208_out, inst202_out, sym7);
  not inst208 (inst208_out, sym2);
  not inst202 (inst202_out, sym5);
  and inst282 (inst282_out, clk1, 1'b1);
  and inst285 (inst285_out, clk1, 1'b1);
  and inst293 (inst293_out, clk1, 1'b1);
  and inst294 (inst294_out, clk1, 1'b1);
  lpm_bustri8 inst211 (.enabledt(inst214_out), .data(inst282_out), .tridata(control_enb5_w));
  and inst214 (inst214_out, sym6, sym3, inst248_out);
  lpm_bustri8 inst217 (.enabledt(inst223_out), .data(inst285_out), .tridata(control_enb6_w));
  not inst224 (inst224_out, sym3);
  lpm_bustri8 inst241 (.enabledt(inst242_out), .data(inst293_out), .tridata(control_enb7_w));
  lpm_bustri8 inst244 (.enabledt(inst245_out), .data(inst294_out), .tridata(control_enb8_w));
  not inst247 (inst247_out, sym4);
  not inst248 (inst248_out, sym7);
  and inst223 (inst223_out, inst224_out, sym6, inst249_out);
  not inst249 (inst249_out, sym7);
  and inst242 (inst242_out, sym4, inst243_out, inst250_out);
  not inst243 (inst243_out, sym6);
  and inst245 (inst245_out, inst247_out, inst246_out, inst251_out);
  not inst246 (inst246_out, sym6);
  not inst250 (inst250_out, sym7);
  not inst251 (inst251_out, sym7);

  // Other names for the same wires on the sheet: q1[7:1] = q1_d; q1_sum[2:0] = q1_d2; q2[7:1] = q1_d149;
  //   q2_sum[2:0] = q1_d156; q3[7:1] = q1_d150; q3_sum[2:0] = q1_d157; q4[7:1] = q1_d151; q4_sum[2:0] = q1_d158;
  //   q5[7:1] = q1_d152; q5_sum[2:0] = q1_d159; q6[7:1] = q1_d153; q6_sum[2:0] = q1_d160; q7[7:1] = q1_d154;
  //   q7_sum[2:0] = q1_d161; q8[7:1] = q1_d155; q8_sum[2:0] = q1_d162
endmodule
